# Altium schematic sheet [00]Connectors.SchDoc
size A4; SheetNumber: 5; SheetTotal: 5
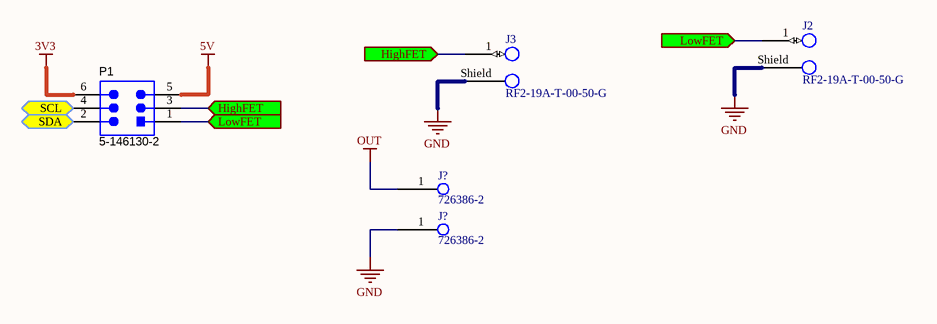
[diagram p0: [00]Connectors.SchDoc]

## Parts
(Parts that share a designator on the sheet are numbered #1, #2 ... from top to bottom, then left to right.)
J2  RF2-19A-T-00-50-G  [RF2-19A-T-00-50-G]
J3  RF2-19A-T-00-50-G  [RF2-19A-T-00-50-G]
J?#1  726386-2  [1844210]
J?#2  726386-2  [1844210]
P1  5-146130-2  [TECO-5-146130-2_V]

## Ports
HighFET (in, see [00]Connectors[2B], [05]BuckConverter[1E], [05]BuckConverter[2E]), HighFET (in, see [00]Connectors[3B], [05]BuckConverter[1E], [05]BuckConverter[2E]), LowFET (in, see [00]Connectors[2B], [05]BuckConverter[1E], [05]BuckConverter[2E]), LowFET (in, see [00]Connectors[3B], [05]BuckConverter[1E], [05]BuckConverter[2E]), SCL (bidir, see [06]TemperatureSense[2C], [06]TemperatureSense[4C]), SDA (bidir, see [06]TemperatureSense[2B], [06]TemperatureSense[4C])

## Nets
3V3: P1.6
5V: P1.5
GND: J2.Shield J3.Shield J?#2.1
OUT: J?#1.1
HighFET: J3.1 P1.3 ; port HighFET
LowFET: J2.1 P1.1 ; port LowFET
SCL: P1.4 ; port SCL
SDA: P1.2 ; port SDA

## Library data of the parts
J2 J3 = CMP-00025-2: Rf Sma Connector
J?#1 J?#2 = CMP-00026-1
P1 = CMP-002-00018-2: Male Header, Pitch 2.54 mm, 2 x 3 Position, Height 8.13 mm, -65 to 125 degC, RoHS, Tube; Manufacturer: TE Connectivity; Max Operating Temperature: 125°C; Datasheet Version: Oct-15; Package Description: Male Header, Pitch 2.54 mm, 2 x 3 Position, Height 8.13 mm; Case/Package: 5-146130-2; Datasheet URL: http://www.te.com/commerce/DocumentDelivery/DDEController?Action=showdoc&DocId=Customer+Drawing%7F146130%7FM%7Fpdf%7FEnglish%7FENG_CD_146130_M.pdf%7F5-146130-2; Manufacturer URL: http://www.te.com/; Connector Type: Header; Gender: Male; Mounting Technology: SM; Min Operating Temperature: -65°C; RoHS Compliant: Unknown; Package Reference: 5-146130-2